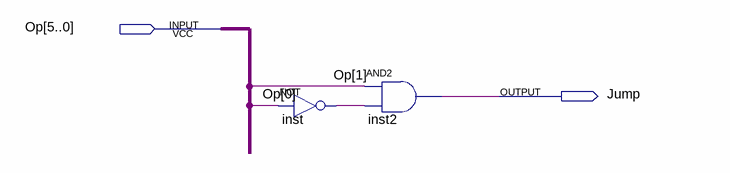
[diagram p0: schematic sheet]
// Quartus schematic jumpDecoder.bdf as structural Verilog: 2 symbols, 2 pins
module jumpDecoder (
  input  [5:0] Op,
  output Jump
);

  wire inst_out;

  not inst (inst_out, Op[0]);
  and inst2 (Jump, Op[1], inst_out);
endmodule
